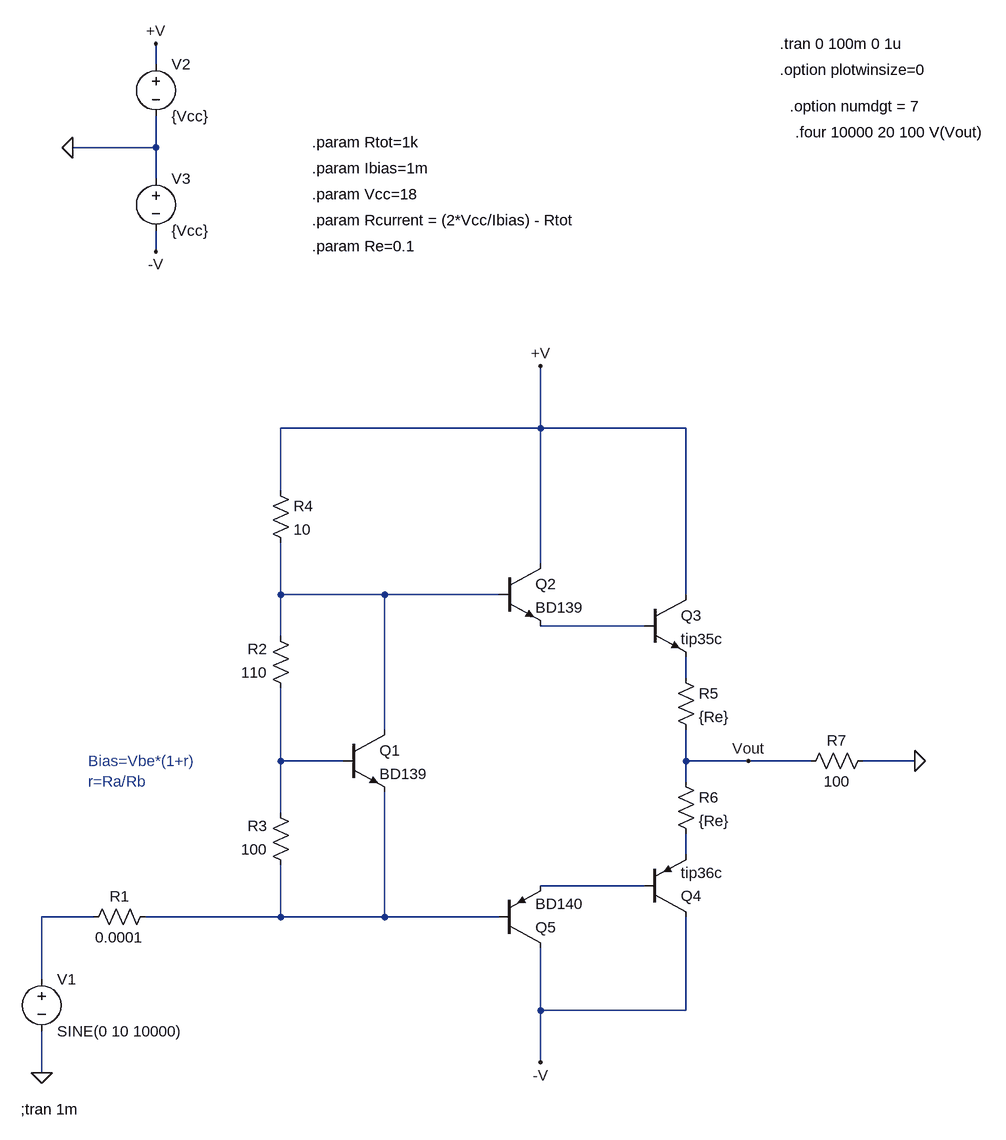
[diagram p0: schematic Draft4.asc]
Draft4.asc, the LTspice schematic file:
Version 4
SHEET 1 880 1000
WIRE -512 -624 -512 -656
WIRE -512 -496 -512 -544
WIRE -512 -496 -640 -496
WIRE -512 -448 -512 -496
WIRE -512 -336 -512 -368
WIRE 80 -64 80 -160
WIRE 80 -64 -320 -64
WIRE 304 -64 80 -64
WIRE -320 32 -320 -64
WIRE 80 144 80 -64
WIRE -320 192 -320 112
WIRE -160 192 -320 192
WIRE 16 192 -160 192
WIRE 304 192 304 -64
WIRE 240 240 80 240
WIRE -320 256 -320 192
WIRE 304 320 304 288
WIRE -160 400 -160 192
WIRE -320 448 -320 336
WIRE -224 448 -320 448
WIRE 304 448 304 400
WIRE 400 448 304 448
WIRE 496 448 400 448
WIRE 656 448 576 448
WIRE 304 480 304 448
WIRE -320 528 -320 448
WIRE 304 592 304 560
WIRE 240 640 80 640
WIRE -608 688 -688 688
WIRE -320 688 -320 608
WIRE -320 688 -528 688
WIRE -160 688 -160 496
WIRE -160 688 -320 688
WIRE 16 688 -160 688
WIRE -688 784 -688 688
WIRE 80 832 80 736
WIRE 304 832 304 688
WIRE 304 832 80 832
WIRE 80 912 80 832
WIRE -688 928 -688 864
FLAG 80 -160 +V
FLAG 80 912 -V
FLAG -688 928 0
FLAG -640 -496 0
FLAG -512 -656 +V
FLAG -512 -336 -V
FLAG 656 448 0
FLAG 400 448 Vout
SYMBOL voltage -688 768 R0
WINDOW 123 0 0 Left 0
WINDOW 39 0 0 Left 0
SYMATTR InstName V1
SYMATTR Value SINE(0 10 10000)
SYMBOL res -512 672 R90
WINDOW 0 0 56 VBottom 2
WINDOW 3 32 56 VTop 2
SYMATTR InstName R1
SYMATTR Value 0.0001
SYMBOL res -304 352 R180
WINDOW 0 36 76 Left 2
WINDOW 3 36 40 Left 2
SYMATTR InstName R2
SYMATTR Value 110
SYMBOL res -304 624 R180
WINDOW 0 36 76 Left 2
WINDOW 3 36 40 Left 2
SYMATTR InstName R3
SYMATTR Value 100
SYMBOL npn -224 400 R0
SYMATTR InstName Q1
SYMATTR Value BD139
SYMBOL npn 16 144 R0
SYMATTR InstName Q2
SYMATTR Value BD139
SYMBOL npn 240 192 R0
SYMATTR InstName Q3
SYMATTR Value tip35c
SYMBOL res -336 16 R0
SYMATTR InstName R4
SYMATTR Value 10
SYMBOL pnp 240 688 M180
SYMATTR InstName Q4
SYMATTR Value tip36c
SYMBOL pnp 16 736 M180
SYMATTR InstName Q5
SYMATTR Value BD140
SYMBOL res 288 304 R0
SYMATTR InstName R5
SYMATTR Value {Re}
SYMBOL res 288 464 R0
SYMATTR InstName R6
SYMATTR Value {Re}
SYMBOL voltage -512 -640 R0
WINDOW 123 0 0 Left 0
WINDOW 39 0 0 Left 0
SYMATTR InstName V2
SYMATTR Value {Vcc}
SYMBOL voltage -512 -464 R0
WINDOW 123 0 0 Left 0
WINDOW 39 0 0 Left 0
SYMATTR InstName V3
SYMATTR Value {Vcc}
SYMBOL res 592 432 R90
WINDOW 0 0 56 VBottom 2
WINDOW 3 32 56 VTop 2
SYMATTR InstName R7
SYMATTR Value 100
TEXT -616 448 Left 2 ;Bias=Vbe*(1+r)\nr=Ra/Rb
TEXT -272 -504 Left 2 !.param Rtot=1k
TEXT -272 -464 Left 2 !.param Ibias=1m
TEXT -272 -424 Left 2 !.param Vcc=18
TEXT -272 -384 Left 2 !.param Rcurrent = (2*Vcc/Ibias) - Rtot
TEXT -272 -344 Left 2 !.param Re=0.1
TEXT -720 984 Left 2 !;tran 1m
TEXT 448 -656 Left 2 !.tran 0 100m 0 1u
TEXT 448 -616 Left 2 !.option plotwinsize=0
TEXT 464 -560 Left 2 !.option numdgt = 7
TEXT 472 -520 Left 2 !.four 10000 20 100 V(Vout)

The netlist it stands for:
* Draft4.asc
V1 N007 0 SINE(0 10 10000)
R1 N008 N007 0.0001
R2 N004 N001 110
R3 N008 N004 100
Q1 N001 N004 N008 0 BD139
Q2 +V N001 N002 0 BD139
Q3 +V N002 N003 0 tip35c
R4 +V N001 10
Q4 -V N006 N005 0 tip36c
Q5 -V N008 N006 0 BD140
R5 N003 Vout {Re}
R6 Vout N005 {Re}
V2 +V 0 {Vcc}
V3 0 -V {Vcc}
R7 0 Vout 100
.model NPN NPN
.model PNP PNP
.lib standard.bjt
* Bias=Vbe*(1+r)
* r=Ra/Rb
.param Rtot=1k
.param Ibias=1m
.param Vcc=18
.param Rcurrent = (2*Vcc/Ibias) - Rtot
.param Re=0.1
;tran 1m
.tran 0 100m 0 1u
.option plotwinsize=0
.option numdgt = 7
.four 10000 20 100 V(Vout)
.backanno
.end